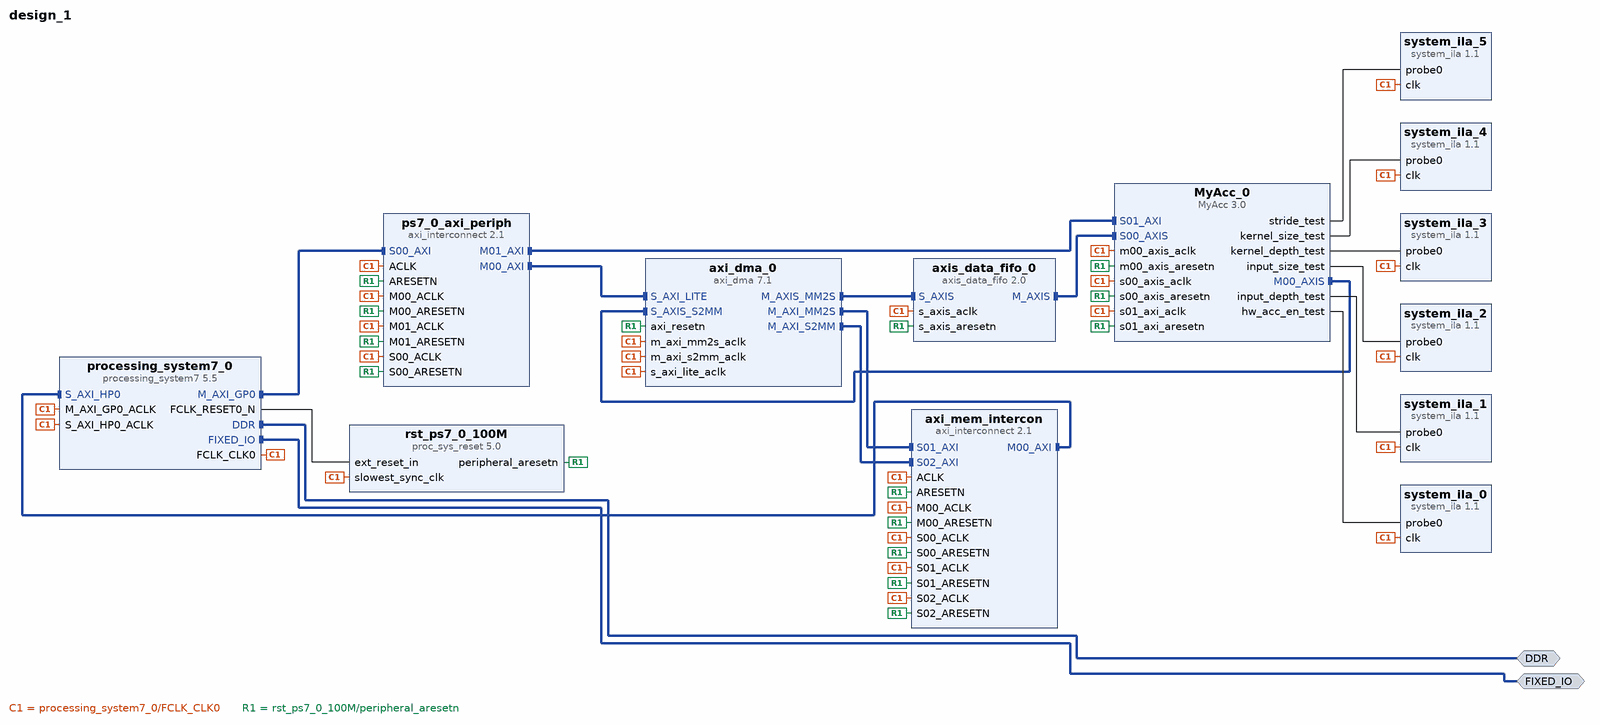
[diagram p0: block diagram of the top level]
# Vivado block design design_1, xc7z010clg400-1, Vivado 2020.1
create_bd_design design_1

create_bd_intf_port -mode Master -vlnv xilinx.com:interface:ddrx_rtl:1.0 DDR
create_bd_intf_port -mode Master -vlnv xilinx.com:display_processing_system7:fixedio_rtl:1.0 FIXED_IO

create_bd_cell -type ip -vlnv xilinx.com:ip:axi_interconnect:2.1 axi_mem_intercon
set_property -dict {CONFIG.NUM_MI 1 CONFIG.NUM_SI 3} [get_bd_cells axi_mem_intercon]
create_bd_cell -type ip -vlnv xilinx.com:ip:axi_interconnect:2.1 ps7_0_axi_periph
set_property -dict {CONFIG.NUM_MI 2} [get_bd_cells ps7_0_axi_periph]
create_bd_cell -type ip -vlnv xilinx.com:ip:axi_dma:7.1 axi_dma_0
set_property -dict [list \
  CONFIG.c_include_mm2s_dre 1 \
  CONFIG.c_include_s2mm 1 \
  CONFIG.c_include_s2mm_dre 1 \
  CONFIG.c_include_sg 0 \
  CONFIG.c_sg_length_width 21 \
] [get_bd_cells axi_dma_0]
create_bd_cell -type ip -vlnv xilinx.com:ip:axis_data_fifo:2.0 axis_data_fifo_0
create_bd_cell -type ip -vlnv xilinx.com:ip:processing_system7:5.5 processing_system7_0
set_property -dict [list \
  CONFIG.PCW_APU_PERIPHERAL_FREQMHZ 650 \
  CONFIG.PCW_CRYSTAL_PERIPHERAL_FREQMHZ 50.000000 \
  CONFIG.PCW_ENET0_ENET0_IO {MIO 16 .. 27} \
  CONFIG.PCW_ENET0_GRP_MDIO_ENABLE 1 \
  CONFIG.PCW_ENET0_GRP_MDIO_IO {MIO 52 .. 53} \
  CONFIG.PCW_ENET0_PERIPHERAL_ENABLE 1 \
  CONFIG.PCW_ENET0_RESET_ENABLE 0 \
  CONFIG.PCW_ENET_RESET_ENABLE 1 \
  CONFIG.PCW_ENET_RESET_SELECT {Share reset pin} \
  CONFIG.PCW_FPGA0_PERIPHERAL_FREQMHZ 50 \
  CONFIG.PCW_FPGA1_PERIPHERAL_FREQMHZ 50 \
  CONFIG.PCW_GP0_EN_MODIFIABLE_TXN 0 \
  CONFIG.PCW_GP1_EN_MODIFIABLE_TXN 0 \
  CONFIG.PCW_GPIO_MIO_GPIO_ENABLE 1 \
  CONFIG.PCW_GPIO_MIO_GPIO_IO MIO \
  CONFIG.PCW_I2C_RESET_ENABLE 1 \
  CONFIG.PCW_PERIPHERAL_BOARD_PRESET part0 \
  CONFIG.PCW_PRESET_BANK1_VOLTAGE {LVCMOS 1.8V} \
  CONFIG.PCW_QSPI_GRP_FBCLK_ENABLE 1 \
  CONFIG.PCW_QSPI_GRP_FBCLK_IO {MIO 8} \
  CONFIG.PCW_QSPI_GRP_SINGLE_SS_ENABLE 1 \
  CONFIG.PCW_QSPI_GRP_SINGLE_SS_IO {MIO 1 .. 6} \
  CONFIG.PCW_QSPI_PERIPHERAL_ENABLE 1 \
  CONFIG.PCW_QSPI_QSPI_IO {MIO 1 .. 6} \
  CONFIG.PCW_SD0_GRP_CD_ENABLE 1 \
  CONFIG.PCW_SD0_GRP_CD_IO {MIO 47} \
  CONFIG.PCW_SD0_GRP_WP_ENABLE 1 \
  CONFIG.PCW_SD0_GRP_WP_IO EMIO \
  CONFIG.PCW_SD0_PERIPHERAL_ENABLE 1 \
  CONFIG.PCW_SD0_SD0_IO {MIO 40 .. 45} \
  CONFIG.PCW_SDIO_PERIPHERAL_FREQMHZ 50 \
  CONFIG.PCW_SINGLE_QSPI_DATA_MODE x4 \
  CONFIG.PCW_S_AXI_HP0_DATA_WIDTH 32 \
  CONFIG.PCW_TTC0_PERIPHERAL_ENABLE 1 \
  CONFIG.PCW_TTC0_TTC0_IO EMIO \
  CONFIG.PCW_UART1_PERIPHERAL_ENABLE 1 \
  CONFIG.PCW_UART1_UART1_IO {MIO 48 .. 49} \
  CONFIG.PCW_UART_PERIPHERAL_FREQMHZ 100 \
  CONFIG.PCW_UIPARAM_DDR_FREQ_MHZ 525 \
  CONFIG.PCW_UIPARAM_DDR_PARTNO {MT41K128M16 JT-125} \
  CONFIG.PCW_USB0_PERIPHERAL_ENABLE 1 \
  CONFIG.PCW_USB0_RESET_ENABLE 1 \
  CONFIG.PCW_USB0_RESET_IO {MIO 46} \
  CONFIG.PCW_USB0_USB0_IO {MIO 28 .. 39} \
  CONFIG.PCW_USB_RESET_ENABLE 1 \
  CONFIG.PCW_USB_RESET_SELECT {Share reset pin} \
  CONFIG.PCW_USE_S_AXI_HP0 1 \
] [get_bd_cells processing_system7_0]
# 499 more settings of processing_system7_0 are not shown: defaults, MIO pin electricals, DDR timing, and values the tool derives
create_bd_cell -type ip -vlnv xilinx.com:ip:proc_sys_reset:5.0 rst_ps7_0_100M
create_bd_cell -type ip -vlnv xilinx.com:user:MyAcc:3.0 MyAcc_0
create_bd_cell -type ip -vlnv xilinx.com:ip:system_ila:1.1 system_ila_0
set_property -dict {CONFIG.C_MON_TYPE NATIVE CONFIG.C_NUM_OF_PROBES 1 CONFIG.C_PROBE0_TYPE 0} [get_bd_cells system_ila_0]
create_bd_cell -type ip -vlnv xilinx.com:ip:system_ila:1.1 system_ila_1
set_property -dict {CONFIG.C_MON_TYPE NATIVE CONFIG.C_NUM_OF_PROBES 1 CONFIG.C_PROBE0_TYPE 0} [get_bd_cells system_ila_1]
create_bd_cell -type ip -vlnv xilinx.com:ip:system_ila:1.1 system_ila_2
set_property -dict {CONFIG.C_MON_TYPE NATIVE CONFIG.C_NUM_OF_PROBES 1 CONFIG.C_PROBE0_TYPE 0} [get_bd_cells system_ila_2]
create_bd_cell -type ip -vlnv xilinx.com:ip:system_ila:1.1 system_ila_3
set_property -dict {CONFIG.C_MON_TYPE NATIVE CONFIG.C_NUM_OF_PROBES 1 CONFIG.C_PROBE0_TYPE 0} [get_bd_cells system_ila_3]
create_bd_cell -type ip -vlnv xilinx.com:ip:system_ila:1.1 system_ila_4
set_property -dict {CONFIG.C_MON_TYPE NATIVE CONFIG.C_NUM_OF_PROBES 1 CONFIG.C_PROBE0_TYPE 0} [get_bd_cells system_ila_4]
create_bd_cell -type ip -vlnv xilinx.com:ip:system_ila:1.1 system_ila_5
set_property -dict {CONFIG.C_MON_TYPE NATIVE CONFIG.C_NUM_OF_PROBES 1 CONFIG.C_PROBE0_TYPE 0} [get_bd_cells system_ila_5]

# ---- connections ----

connect_bd_intf_net [get_bd_intf_pins MyAcc_0/S00_AXIS] [get_bd_intf_pins axis_data_fifo_0/M_AXIS]
connect_bd_intf_net [get_bd_intf_pins ps7_0_axi_periph/M01_AXI] [get_bd_intf_pins MyAcc_0/S01_AXI]
connect_bd_intf_net [get_bd_intf_pins axi_dma_0/M_AXI_MM2S] [get_bd_intf_pins axi_mem_intercon/S01_AXI]
connect_bd_intf_net [get_bd_intf_ports DDR] [get_bd_intf_pins processing_system7_0/DDR]
connect_bd_intf_net [get_bd_intf_pins processing_system7_0/M_AXI_GP0] [get_bd_intf_pins ps7_0_axi_periph/S00_AXI]
connect_bd_intf_net [get_bd_intf_ports FIXED_IO] [get_bd_intf_pins processing_system7_0/FIXED_IO]
connect_bd_intf_net [get_bd_intf_pins ps7_0_axi_periph/M00_AXI] [get_bd_intf_pins axi_dma_0/S_AXI_LITE]
connect_bd_intf_net [get_bd_intf_pins axi_dma_0/M_AXI_S2MM] [get_bd_intf_pins axi_mem_intercon/S02_AXI]
connect_bd_intf_net [get_bd_intf_pins axi_mem_intercon/M00_AXI] [get_bd_intf_pins processing_system7_0/S_AXI_HP0]
connect_bd_intf_net [get_bd_intf_pins axi_dma_0/M_AXIS_MM2S] [get_bd_intf_pins axis_data_fifo_0/S_AXIS]
connect_bd_intf_net [get_bd_intf_pins MyAcc_0/M00_AXIS] [get_bd_intf_pins axi_dma_0/S_AXIS_S2MM]
connect_bd_net [get_bd_pins processing_system7_0/FCLK_CLK0] \
  [get_bd_pins axi_mem_intercon/ACLK] [get_bd_pins axi_mem_intercon/S00_ACLK] [get_bd_pins axi_mem_intercon/M00_ACLK] \
  [get_bd_pins axi_mem_intercon/S01_ACLK] [get_bd_pins axi_mem_intercon/S02_ACLK] [get_bd_pins ps7_0_axi_periph/ACLK] \
  [get_bd_pins ps7_0_axi_periph/S00_ACLK] [get_bd_pins ps7_0_axi_periph/M00_ACLK] [get_bd_pins axi_dma_0/s_axi_lite_aclk] \
  [get_bd_pins axi_dma_0/m_axi_mm2s_aclk] [get_bd_pins axis_data_fifo_0/s_axis_aclk] [get_bd_pins ps7_0_axi_periph/M01_ACLK] \
  [get_bd_pins processing_system7_0/M_AXI_GP0_ACLK] [get_bd_pins processing_system7_0/S_AXI_HP0_ACLK] \
  [get_bd_pins rst_ps7_0_100M/slowest_sync_clk] [get_bd_pins axi_dma_0/m_axi_s2mm_aclk] [get_bd_pins MyAcc_0/s01_axi_aclk] \
  [get_bd_pins MyAcc_0/m00_axis_aclk] [get_bd_pins MyAcc_0/s00_axis_aclk] [get_bd_pins system_ila_0/clk] \
  [get_bd_pins system_ila_1/clk] [get_bd_pins system_ila_2/clk] [get_bd_pins system_ila_3/clk] [get_bd_pins system_ila_4/clk] \
  [get_bd_pins system_ila_5/clk]
connect_bd_net [get_bd_pins processing_system7_0/FCLK_RESET0_N] [get_bd_pins rst_ps7_0_100M/ext_reset_in]
connect_bd_net [get_bd_pins rst_ps7_0_100M/peripheral_aresetn] \
  [get_bd_pins axi_mem_intercon/ARESETN] [get_bd_pins axi_mem_intercon/S00_ARESETN] \
  [get_bd_pins axi_mem_intercon/M00_ARESETN] [get_bd_pins axi_mem_intercon/S01_ARESETN] \
  [get_bd_pins axi_mem_intercon/S02_ARESETN] [get_bd_pins ps7_0_axi_periph/ARESETN] \
  [get_bd_pins ps7_0_axi_periph/S00_ARESETN] [get_bd_pins ps7_0_axi_periph/M00_ARESETN] [get_bd_pins axi_dma_0/axi_resetn] \
  [get_bd_pins axis_data_fifo_0/s_axis_aresetn] [get_bd_pins ps7_0_axi_periph/M01_ARESETN] \
  [get_bd_pins MyAcc_0/s01_axi_aresetn] [get_bd_pins MyAcc_0/m00_axis_aresetn] [get_bd_pins MyAcc_0/s00_axis_aresetn]
connect_bd_net -net kernel_size_test [get_bd_pins MyAcc_0/kernel_size_test] [get_bd_pins system_ila_4/probe0]
connect_bd_net -net kernel_depth_test [get_bd_pins MyAcc_0/kernel_depth_test] [get_bd_pins system_ila_3/probe0]
connect_bd_net -net input_size_test [get_bd_pins MyAcc_0/input_size_test] [get_bd_pins system_ila_2/probe0]
connect_bd_net -net input_depth_test [get_bd_pins MyAcc_0/input_depth_test] [get_bd_pins system_ila_1/probe0]
connect_bd_net -net stride_test [get_bd_pins MyAcc_0/stride_test] [get_bd_pins system_ila_5/probe0]
connect_bd_net -net hw_acc_en_test [get_bd_pins MyAcc_0/hw_acc_en_test] [get_bd_pins system_ila_0/probe0]
set_property HDL_ATTRIBUTE.DEBUG true [get_bd_nets kernel_size_test]
set_property HDL_ATTRIBUTE.MARK_DEBUG true [get_bd_nets kernel_size_test]
set_property HDL_ATTRIBUTE.DEBUG true [get_bd_nets kernel_depth_test]
set_property HDL_ATTRIBUTE.MARK_DEBUG true [get_bd_nets kernel_depth_test]
set_property HDL_ATTRIBUTE.DEBUG true [get_bd_nets input_size_test]
set_property HDL_ATTRIBUTE.MARK_DEBUG true [get_bd_nets input_size_test]
set_property HDL_ATTRIBUTE.DEBUG true [get_bd_nets input_depth_test]
set_property HDL_ATTRIBUTE.MARK_DEBUG true [get_bd_nets input_depth_test]
set_property HDL_ATTRIBUTE.DEBUG true [get_bd_nets stride_test]
set_property HDL_ATTRIBUTE.MARK_DEBUG true [get_bd_nets stride_test]
set_property HDL_ATTRIBUTE.DEBUG true [get_bd_nets hw_acc_en_test]
set_property HDL_ATTRIBUTE.MARK_DEBUG true [get_bd_nets hw_acc_en_test]

# ---- address map ----
assign_bd_address -offset 0x00000000 -range 512M -target_address_space [get_bd_addr_spaces axi_dma_0/Data_MM2S] [get_bd_addr_segs processing_system7_0/S_AXI_HP0/HP0_DDR_LOWOCM]
assign_bd_address -offset 0x00000000 -range 512M -target_address_space [get_bd_addr_spaces axi_dma_0/Data_S2MM] [get_bd_addr_segs processing_system7_0/S_AXI_HP0/HP0_DDR_LOWOCM]
assign_bd_address -offset 0x40400000 -range 64K -target_address_space [get_bd_addr_spaces processing_system7_0/Data] [get_bd_addr_segs axi_dma_0/S_AXI_LITE/Reg]
assign_bd_address -offset 0x43C00000 -range 64K -target_address_space [get_bd_addr_spaces processing_system7_0/Data] [get_bd_addr_segs MyAcc_0/S01_AXI/S01_AXI_reg]

validate_bd_design
save_bd_design
